# Altium schematic sheet Four Bit Decimal Counter.SchDoc
size A; Organization: Altium Limited; Address1: L3, 12a Rodborough Rd; Address2: Frenchs Forest; Address3: NSW; Address4: Australia 2086; DocumentNumber: 4; SheetNumber: 4; SheetTotal: 4
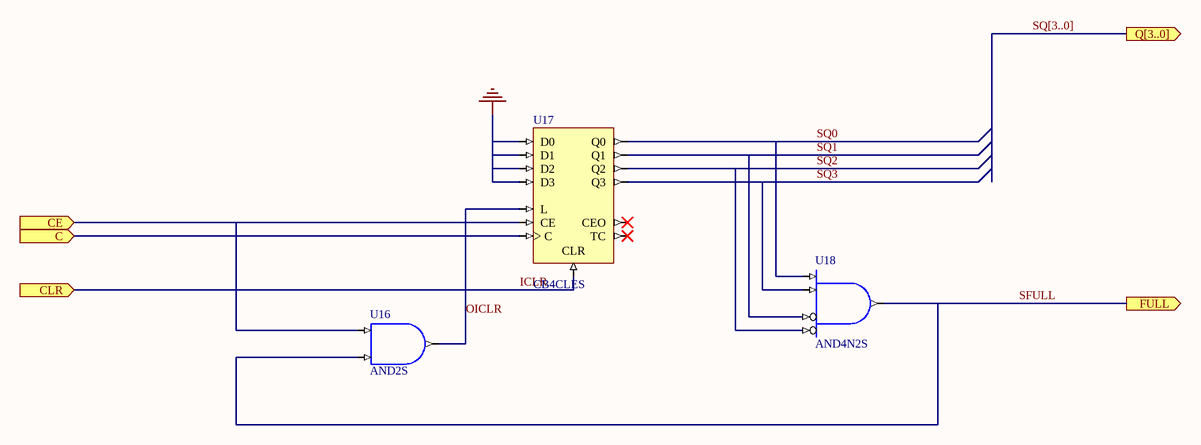
[diagram p0: Four Bit Decimal Counter.SchDoc]

## Parts
U16  AND2S
U17  CB4CLES
U18  AND4N2S

## Ports
C (in), CE (in), CLR (in), FULL (out), Q[3..0] (out)

## Nets
SGND: U17.D0 U17.D1 U17.D2 U17.D3
C: U17.C ; port C
CE: U16.I0 U17.CE ; port CE
ICLR: U17.CLR ; port CLR
OICLR: U16.O U17.L
SFULL: U16.I1 U18.O ; port FULL
SQ0: U17.Q0 U18.I3
SQ1: U17.Q1 U18.I1
SQ2: U17.Q2 U18.I0
SQ3: U17.Q3 U18.I2

Not connected (* = marked no-connect by the designer): U17 CEO* TC*

## Buses and harness runs
bus SQ[3..0] = port Q[3..0]

## Notes on the sheet
- Title
- Size:
- Date:
- A
- Number:
- Time:
- Revision:
- Sheet
- of
- File:

## Library data of the parts
U16 = AND2S: 2-Input AND Gate, Single Pin Version; Xilinx Equivalent: AND2; ArchiveName: GENERIC; VHDLIB_SIM: GENERIC_LIB; Published: 28-Jan-2004; Publisher: Altium Limited; Core Revision: 1.00.00
U17 = CB4CLES: 4-Bit Loadable Cascadable Binary Counter with Clock Enable and Asynchronous Clear, Single Pin Version; Xilinx Equivalent: CB4CLE; ArchiveName: GENERIC; VHDLIB_SIM: GENERIC_LIB; Published: 28-Jan-2004; Publisher: Altium Limited; Core Revision: 1.00.00
U18 = AND4N2S: 4-Input AND Gate with Active Low A and B Inputs, Single Pin Version; Xilinx Equivalent: AND4B2; ArchiveName: GENERIC; VHDLIB_SIM: GENERIC_LIB; Published: 28-Jan-2004; Publisher: Altium Limited; Core Revision: 1.00.00